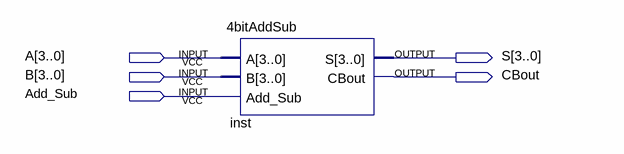
[diagram p0: schematic sheet]
// Quartus schematic L0602.bdf as structural Verilog: 1 symbols, 5 pins
module L0602 (
  input  [3:0] A,
  input  [3:0] B,
  input  Add_Sub,
  output [3:0] S,
  output CBout
);

  \4bitAddSub  inst (.A(A), .B(B), .Add_Sub(Add_Sub), .S(S), .CBout(CBout));
endmodule
